# Altium schematic sheet MCU.SchDoc
size 420 x 297 mm; DocumentNumber: Core of logic
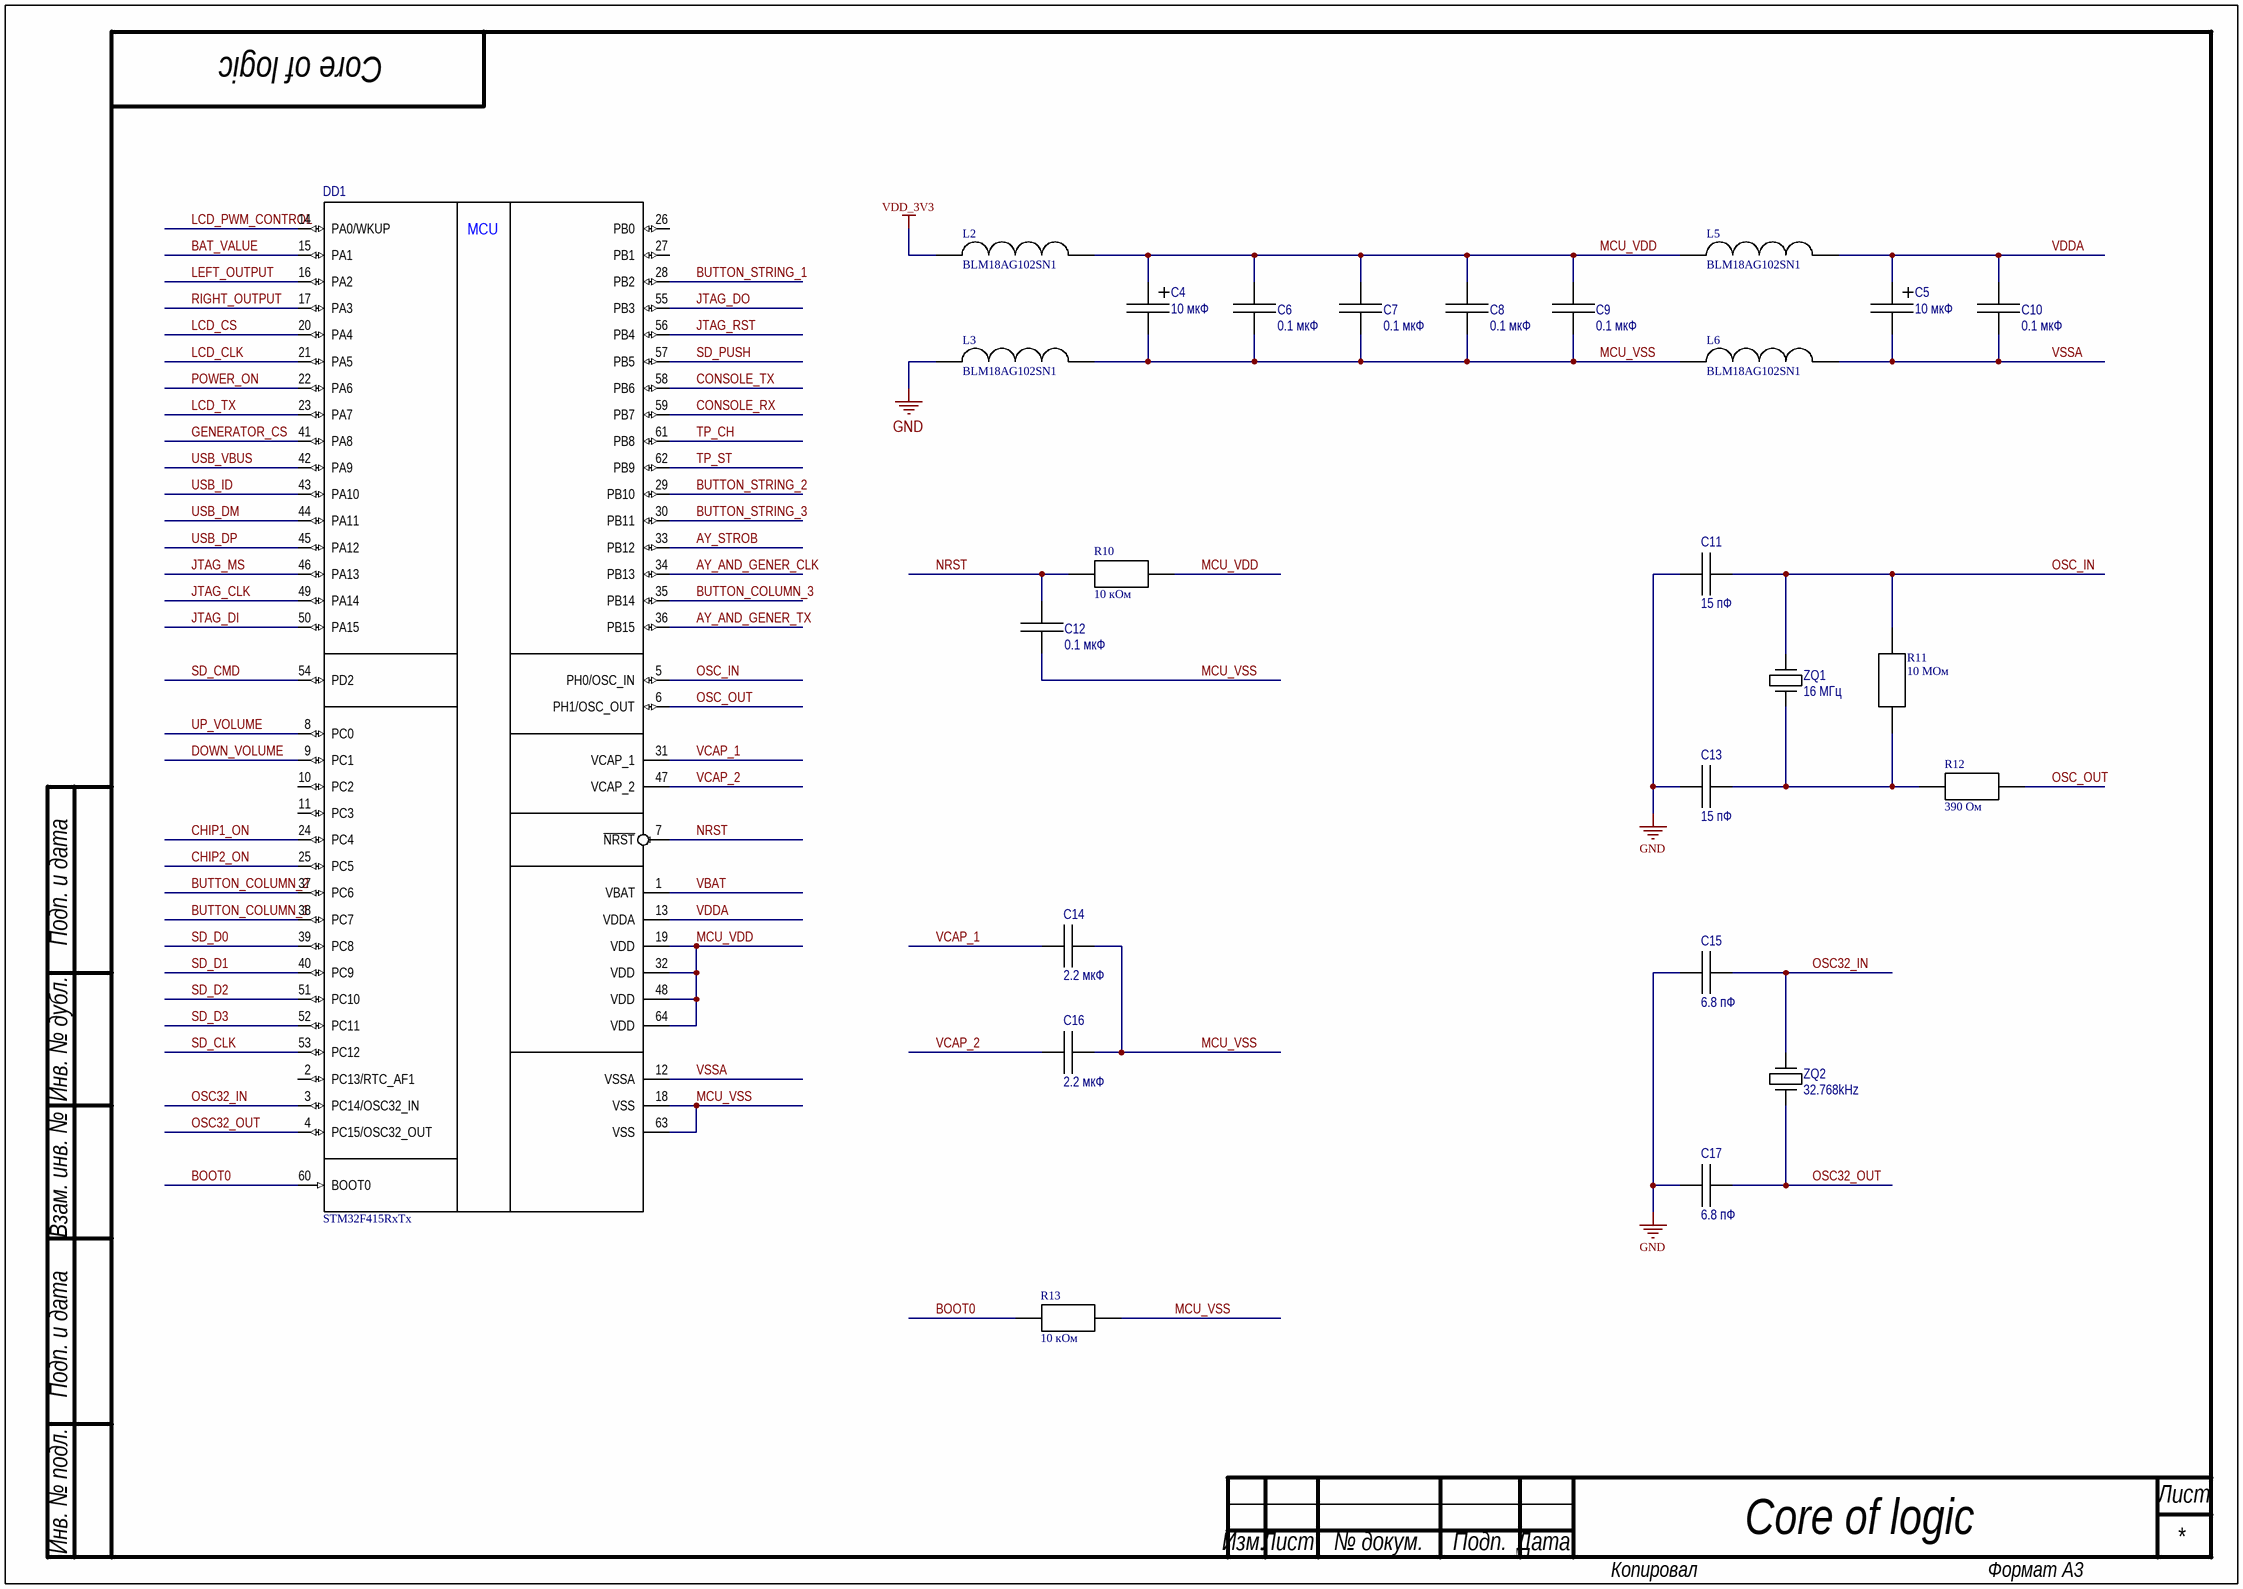
[diagram p0: MCU.SchDoc]

## Parts
C4  10 мкФ  [C TAN_A]
C5  10 мкФ  [C TAN_A]
C6  0.1 мкФ  [C 0805]
C7  0.1 мкФ  [C 0805]
C8  0.1 мкФ  [C 0805]
C9  0.1 мкФ  [C 0805]
C10  0.1 мкФ  [C 0805]
C11  15 пФ  [C 0805]
C12  0.1 мкФ  [C 0805]
C13  15 пФ  [C 0805]
C14  2.2 мкФ  [C 0805]
C15  6.8 пФ  [C 0805]
C16  2.2 мкФ  [C 0805]
C17  6.8 пФ  [C 0805]
DD1  STM32F415RxTx  [LQFP64]
L2  BLM18AG102SN1  [FB 0603]
L3  BLM18AG102SN1  [FB 0603]
L5  BLM18AG102SN1  [FB 0603]
L6  BLM18AG102SN1  [FB 0603]
R10  10 кОм  [RES 0402]
R11  10 МОм  [RES 0402]
R12  390 Ом  [RES 0402]
R13  10 кОм  [RES 0402]
ZQ1  value 16 МГц  [NX3225SA]  (hidden comment: NX3225SA-16.000M-STD-CRS-2)
ZQ2  value 32.768kHz  [MC-306]  (hidden comment: MC-306)

## Nets
GND: C11.2 C13.2 C15.2 C17.2 L3.1
VDD_3V3: L2.1
AY_AND_GENER_CLK: DD1.34(PB13)
AY_AND_GENER_TX: DD1.36(PB15)
AY_STROB: DD1.33(PB12)
BAT_VALUE: DD1.15(PA1)
BOOT0: DD1.60(BOOT0) R13.1
BUTTON_COLUMN_1: DD1.38(PC7)
BUTTON_COLUMN_2: DD1.37(PC6)
BUTTON_COLUMN_3: DD1.35(PB14)
BUTTON_STRING_1: DD1.28(PB2)
BUTTON_STRING_2: DD1.29(PB10)
BUTTON_STRING_3: DD1.30(PB11)
CHIP1_ON: DD1.24(PC4)
CHIP2_ON: DD1.25(PC5)
CONSOLE_RX: DD1.59(PB7)
CONSOLE_TX: DD1.58(PB6)
DOWN_VOLUME: DD1.9(PC1)
GENERATOR_CS: DD1.41(PA8)
JTAG_CLK: DD1.49(PA14)
JTAG_DI: DD1.50(PA15)
JTAG_DO: DD1.55(PB3)
JTAG_MS: DD1.46(PA13)
JTAG_RST: DD1.56(PB4)
LCD_CLK: DD1.21(PA5)
LCD_CS: DD1.20(PA4)
LCD_PWM_CONTROL: DD1.14(PA0/WKUP)
LCD_TX: DD1.23(PA7)
LEFT_OUTPUT: DD1.16(PA2)
MCU_VDD: C4.1 C6.2 C7.2 C8.2 C9.2 DD1.19(VDD) DD1.32(VDD) DD1.48(VDD) DD1.64(VDD) L2.2 L5.1 R10.2
MCU_VSS: C4.2 C6.1 C7.1 C8.1 C9.1 C12.1 C14.2 C16.2 DD1.18(VSS) DD1.63(VSS) L3.2 L6.1 R13.2
NRST: C12.2 DD1.7(~{NRST}) R10.1
OSC32_IN: C15.1 DD1.3(PC14/OSC32_IN) ZQ2.4(NC)
OSC32_OUT: C17.1 DD1.4(PC15/OSC32_OUT) ZQ2.1(XI)
OSC_IN: C11.1 DD1.5(PH0/OSC_IN) R11.2 ZQ1.3(XO)
OSC_OUT: DD1.6(PH1/OSC_OUT) R12.1
POWER_ON: DD1.22(PA6)
RIGHT_OUTPUT: DD1.17(PA3)
SD_CLK: DD1.53(PC12)
SD_CMD: DD1.54(PD2)
SD_D0: DD1.39(PC8)
SD_D1: DD1.40(PC9)
SD_D2: DD1.51(PC10)
SD_D3: DD1.52(PC11)
SD_PUSH: DD1.57(PB5)
TP_CH: DD1.61(PB8)
TP_ST: DD1.62(PB9)
UP_VOLUME: DD1.8(PC0)
USB_DM: DD1.44(PA11)
USB_DP: DD1.45(PA12)
USB_ID: DD1.43(PA10)
USB_VBUS: DD1.42(PA9)
VBAT: DD1.1(VBAT)
VCAP_1: C14.1 DD1.31(VCAP_1)
VCAP_2: C16.1 DD1.47(VCAP_2)
VDDA: C5.1 C10.2 DD1.13(VDDA) L5.2
VSSA: C5.2 C10.1 DD1.12(VSSA) L6.2
NetC13_1: C13.1 R11.1 R12.2 ZQ1.1(XI)

Not connected (* = marked no-connect by the designer): DD1 2(PC13/RTC_AF1) 10(PC2) 11(PC3) 26(PB0) 27(PB1); ZQ1 2(NC) 4(NC); ZQ2 2(NC)

## Notes on the sheet
- Подп. и дата
- Инв. № дубл.
- Взам. инв. №
- Инв. № подл.
- Лист
- Изм.
- № докум.
- Подп.
- Дата
- Копировал
- Формат А3
- (in symbol STM32F415RxTx) MCU

## Library data of the parts
C4 C5 = CAP TAN_A: SMD Tantalium Capacitor A; Type: Конденсатор танталовый; Size: A
C6-C10 C12 C14-C17 = CAP 0805: SMD Capacitor 0805; Type: Конденсатор керамический; Size: 0805
  C6-C10 C12: Value: 0.1 мкФ
  C14 C16: Value: 2.2 мкФ
  C15 C17: Value: 6.8 пФ
C11 C13 = CAP 0805: SMD Capacitor 0805; Type: Конденсатор керамический; Value: 6.8 пФ; Size: 0805
R10-R13 = RES 0402
ZQ1 = NX3225SA-16.000M-STD-CRS-2: QUARTZ CRYSTAL; Manufacturer: NDK; Load capacitance: 8 пФ; Frequency stability: ±15 ppm; Type: Кварцевый резонатор; Temperature range: -40 ... 125 °C
ZQ2 = MC-306: QUARTZ CRYSTAL; Type: Кварцевый резонатор